# Altium schematic sheet CON_PC-104_16bit_40PIN_PC104.SchDoc
size A4
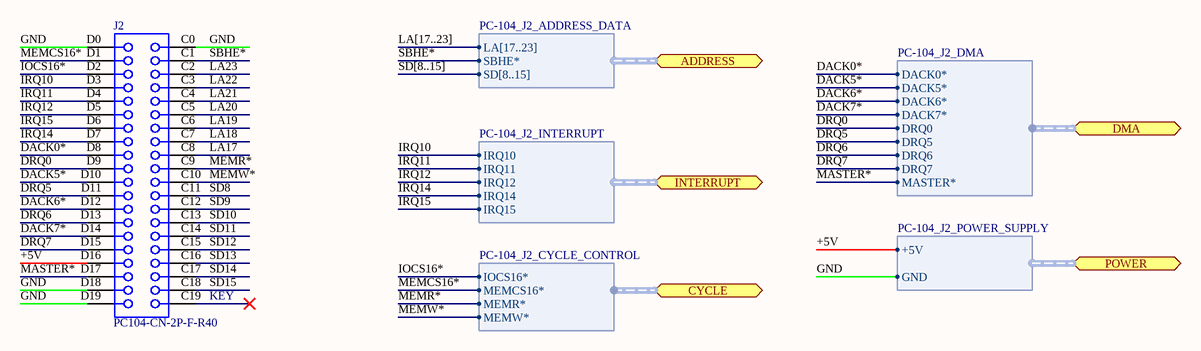
[diagram p0: CON_PC-104_16bit_40PIN_PC104.SchDoc]

## Parts
J2  PC104-CN-2P-F-R40  [BTB2-54-V40F-04]

## Ports
ADDRESS (harness PC-104_J2_ADDRESS_DATA), CYCLE (harness PC-104_J2_CYCLE_CONTROL), DMA (harness PC-104_J2_DMA), INTERRUPT (harness PC-104_J2_INTERRUPT), POWER (harness PC-104_J2_POWER_SUPPLY)

## Harnesses
PC-104_J2_ADDRESS_DATA: LA[17..23], SBHE*, SD[8..15]
PC-104_J2_CYCLE_CONTROL: IOCS16*, MEMCS16*, MEMR*, MEMW*
PC-104_J2_INTERRUPT: IRQ10, IRQ11, IRQ12, IRQ14, IRQ15
PC-104_J2_POWER_SUPPLY: +5V, GND
PC-104_J2_DMA: DACK0*, DACK5*, DACK6*, DACK7*, DRQ0, DRQ5, DRQ6, DRQ7, MASTER*

## Nets
+5V: J2.D16 ; port POWER.+5V
DACK0*: J2.D8 ; port DMA.DACK0*
DACK5*: J2.D10 ; port DMA.DACK5*
DACK6*: J2.D12 ; port DMA.DACK6*
DACK7*: J2.D14 ; port DMA.DACK7*
DRQ0: J2.D9 ; port DMA.DRQ0
DRQ5: J2.D11 ; port DMA.DRQ5
DRQ6: J2.D13 ; port DMA.DRQ6
DRQ7: J2.D15 ; port DMA.DRQ7
GND: J2.C0 J2.D0 J2.D18 J2.D19 ; port POWER.GND
IOCS16*: J2.D2 ; port CYCLE.IOCS16*
IRQ10: J2.D3 ; port INTERRUPT.IRQ10
IRQ11: J2.D4 ; port INTERRUPT.IRQ11
IRQ12: J2.D5 ; port INTERRUPT.IRQ12
IRQ14: J2.D7 ; port INTERRUPT.IRQ14
IRQ15: J2.D6 ; port INTERRUPT.IRQ15
LA17: J2.C8
LA18: J2.C7
LA19: J2.C6
LA20: J2.C5
LA21: J2.C4
LA22: J2.C3
LA23: J2.C2
MASTER*: J2.D17 ; port DMA.MASTER*
MEMCS16*: J2.D1 ; port CYCLE.MEMCS16*
MEMR*: J2.C9 ; port CYCLE.MEMR*
MEMW*: J2.C10 ; port CYCLE.MEMW*
SBHE*: J2.C1 ; port ADDRESS.SBHE*
SD8: J2.C11
SD9: J2.C12
SD10: J2.C13
SD11: J2.C14
SD12: J2.C15
SD13: J2.C16
SD14: J2.C17
SD15: J2.C18

Not connected (* = marked no-connect by the designer): J2 C19(40)*

## Buses and harness runs
bus LA[17..23]
bus SD[8..15]

## Notes on the sheet
- (near J2) KEY
- Title
- Size:
- Date:
- A4
- Number:
- Time:
- Revision:
- Sheet
- of
- File:

## Library data of the parts
J2 = CMP-0001-00107-1: Board-to-Board Connector, PC104 CD ISA, Stackthrough, Vertical, 2-Row, 40-Postion, Pitch 2.54mm, Receptacle; Mating Connector: Harwin-M20-6102005 (stackthrough); Package Reference: BTB2-54-V40F-04; ClassName: Board Template Connector; Component Kind: Standard; Publisher: Altium